# Altium schematic sheet YD-3410_2022-03-15.schdoc
size 41 x 25 mm
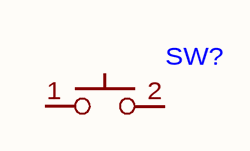
[diagram p0: YD-3410_2022-03-15.schdoc]

## Parts
SW?  (no value)  [SW-SMD_L3.9-W2.9-LS4.8-EH-A]

## Nets

Not connected (* = marked no-connect by the designer): SW? 1 2

## Library data of the parts
SW? = YD-3410